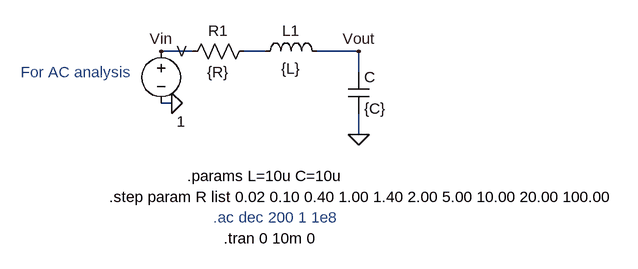
[diagram p0: schematic tut4 i.asc]
tut4 i.asc, the LTspice schematic file:
Version 4
SHEET 1 888 680
WIRE 48 112 0 112
WIRE 160 112 128 112
WIRE 304 112 240 112
WIRE 304 144 304 112
WIRE 16 192 0 192
WIRE 304 240 304 208
FLAG 304 240 0
FLAG 16 192 0
FLAG 304 112 Vout
FLAG 0 112 Vin
SYMBOL res 144 96 R90
WINDOW 0 0 56 VBottom 2
WINDOW 3 32 56 VTop 2
SYMATTR InstName R1
SYMATTR Value {R}
SYMBOL ind 144 128 R270
WINDOW 0 32 56 VTop 2
WINDOW 3 5 56 VBottom 2
SYMATTR InstName L1
SYMATTR Value {L}
SYMBOL cap 288 144 R0
SYMATTR InstName C
SYMATTR Value {C}
SYMBOL voltage 0 96 R0
WINDOW 123 24 124 Left 2
WINDOW 39 0 0 Left 0
SYMATTR InstName V
SYMATTR Value ""
SYMATTR Value2 1
TEXT -216 144 Left 2 ;For AC analysis
TEXT 80 368 Left 2 ;.ac dec 200 1 1e8
TEXT 40 304 Left 2 !.params L=10u C=10u
TEXT -80 336 Left 2 !.step param R list 0.02 0.10 0.40 1.00 1.40 2.00 5.00 10.00 20.00 100.00
TEXT 96 400 Left 2 !.tran 0 10m 0

The netlist it stands for:
* tut4 i.asc
R1 N001 Vin {R}
L1 N001 Vout {L}
C Vout 0 {C}
V Vin 0 1
* For AC analysis
* .ac dec 200 1 1e8
.params L=10u C=10u
.step param R list 0.02 0.10 0.40 1.00 1.40 2.00 5.00 10.00 20.00 100.00
.tran 0 10m 0
.backanno
.end